# Altium schematic sheet USB_OTG_FS.SchDoc
size A
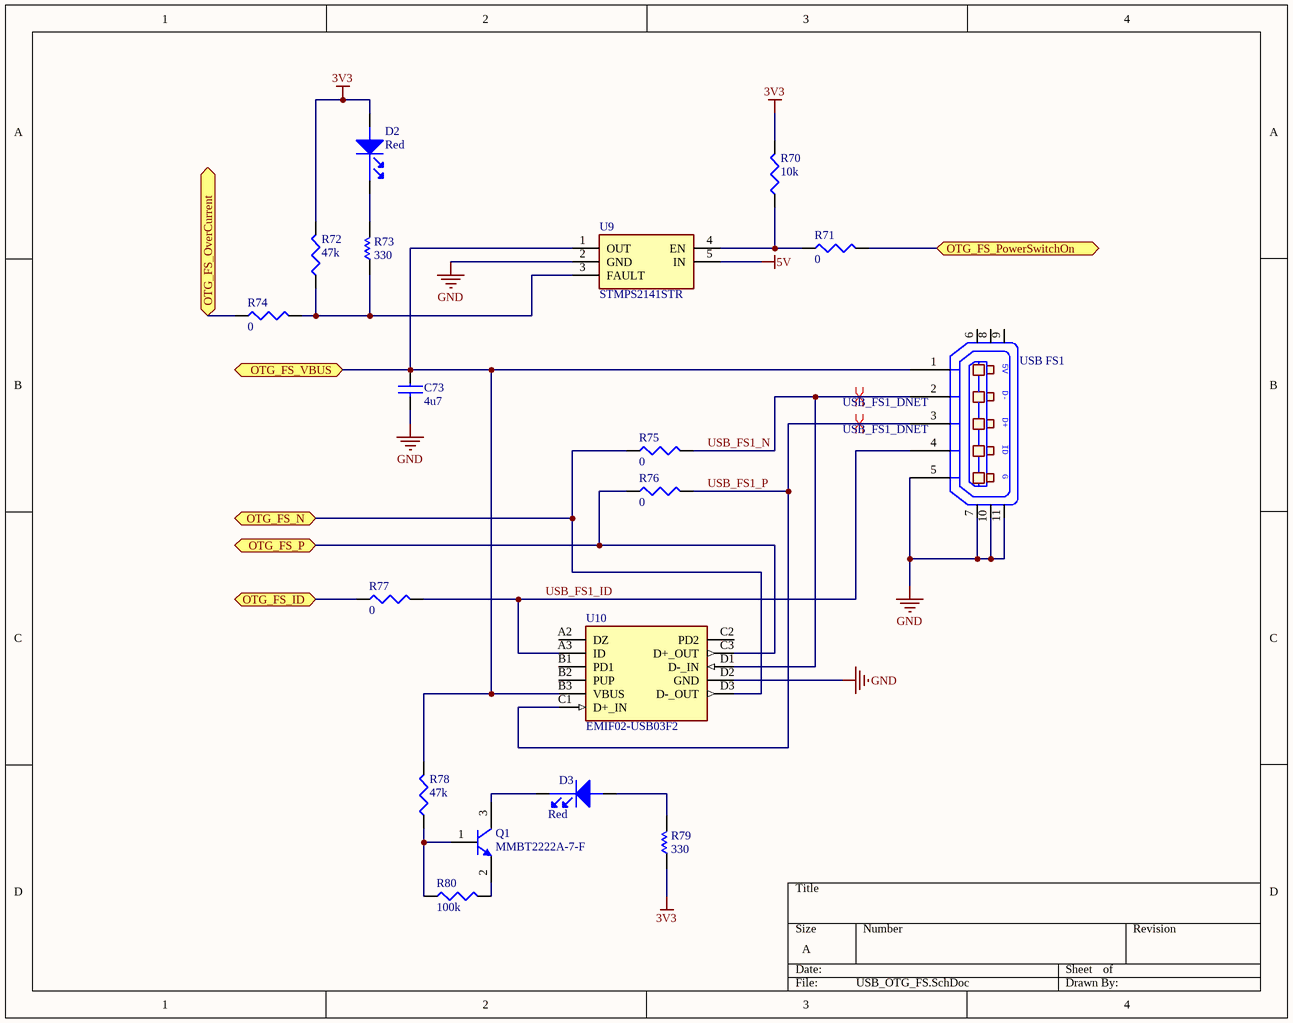
[diagram p0: USB_OTG_FS.SchDoc]

## Parts
C73  4u7  [C0402]
D2  Red  [LED_0603]
D3  Red  [LED_0603]
Q1  MMBT2222A-7-F  [DIOD-SOT23-3_V]
R70  10k  [R0402]
R71  0  [R0402]
R72  47k  [R0402]
R73  330  [RES 1206]
R74  0  [R0402]
R75  0  [R0402]
R76  0  [R0402]
R77  0  [R0402]
R78  47k  [R0402]
R79  330  [RES 1206]
R80  100k  [R0402]
U9  STMPS2141STR  [SOT95P280X145-5N]
U10  EMIF02-USB03F2  [BGA11C50P3X4_144X194X72]
USB_FS1  USB MICRO AB  [USB_Micro_AB]  (value not drawn)

## Ports
OTG_FS_ID (bidir), OTG_FS_N (bidir), OTG_FS_OverCurrent (bidir), OTG_FS_P (bidir), OTG_FS_PowerSwitchOn (bidir), OTG_FS_VBUS (bidir)

## Nets
3V3: D2.2(ANODE) R70.2 R72.2 R79.1
5V: U9.5(IN)
GND: C73.2 U9.2(GND) U10.D2(GND) USB_FS1.5(P5) USB_FS1.7 USB_FS1.10 USB_FS1.11
OTG_FS_ID: R77.1 ; port OTG_FS_ID
OTG_FS_N: R75.1 U10.D3(D-_OUT) ; port OTG_FS_N
OTG_FS_OverCurrent: R74.1 ; port OTG_FS_OverCurrent
OTG_FS_P: R76.1 U10.C3(D+_OUT) ; port OTG_FS_P
OTG_FS_PowerSwitchOn: R71.2 ; port OTG_FS_PowerSwitchOn
OTG_FS_VBUS: C73.1 R78.2 U9.1(OUT) U10.B3(VBUS) USB_FS1.1(P1) ; port OTG_FS_VBUS
USB_FS1_ID: R77.2 U10.A3(ID) USB_FS1.4(P4)
USB_FS1_N: R75.2 U10.D1(D-_IN) USB_FS1.2(P2)
USB_FS1_P: R76.2 U10.C1(D+_IN) USB_FS1.3(P3)
NetD2_1: D2.1(cathode) R73.2
NetD3_1: D3.1(cathode) Q1.3(C)
NetD3_2: D3.2(ANODE) R79.2
NetQ1_1: Q1.1(B) R78.1 R80.1
NetQ1_2: Q1.2(E) R80.2
NetR70_1: R70.1 R71.1 U9.4(EN)
NetR72_1: R72.1 R73.1 R74.2 U9.3(FAULT)

Not connected (* = marked no-connect by the designer): U10 A2(DZ) B1(PD1) B2(PUP) C2(PD2); USB_FS1 6 8 9

## Layout directives
differential pair; differential pair class USB_FS1_DNET: USB_FS1_N, USB_FS1_P

## Notes on the sheet
- (in symbol 0475890001) 5V; D-; D+; ID; G

## Library data of the parts
C73 = C1005X5R1A225K: CAP CER 2.2UF 10V 10% X5R 0402; Manufacturer: TDK Corporation; Capacitance: 2.2µF; .Checked PCB: RF; Supplier 1: Digi-Key; Supplier Part Number 1: 445-7392-1-ND; Manufacturer Part Number: C1005X5R1A225K; RoHS: RoHS Compliant; Category: Capacitors; Stock 1: 22891; Pricing 1: 1=0.42, 10=0.332, 100=0.2, 250=0.15, 500=0.128, 1000=0.1 (USD); Voltage - Rated: 10V; Tolerance: ±10%; Temperature Coefficient: X5R; Mounting Type: Surface Mount, MLCC; Operating Temperature: -55°C ~ 85°C; Applications: General Purpose; Ratings: -; Package / Case: 0402 (1005 Metric); Size / Dimension: 0.039" L x 0.020" W (1.00mm x 0.50mm); Height - Seated (Max): -; Thickness (Max): 0.022" (0.55mm); Lead Spacing: -; Features: -; Packaging: Cut Tape (CT); Lead Style: -; ComponentLink1URL: http://www.tdk.com/pdf/general_B11.pdf; ComponentLink1Description: http://www.tdk.com/pdf/general_B11.pdf; .Checked SCH: RF
D2 D3 = LS L29K-H1J2-1-Z: LED SMARTLED RED 630NM 0603 SMD; Manufacturer: OSRAM Opto Semiconductors Inc; Millicandela Rating: 4.95mcd; Voltage - Forward (Vf) Typ: 1.8V; Current - Test: 2mA; Wavelength - Peak: 643nm; Viewing Angle: 160°; Lens Type: Diffused; Lens Style/Size: Rectangle with Flat Top, 1.3mm x 0.8mm; Luminous Flux @ Current - Test: 20 mlm; .Checked PCB: RF; Supplier 1: Digi-Key; Supplier Part Number 1: 475-1195-1-ND; Manufacturer Part Number: LS L29K-H1J2-1-Z; RoHS: RoHS Compliant; Category: Optoelectronics; Stock 1: 71670; Pricing 1: 1=0.16, 10=0.137, 100=0.1093, 250=0.09564, 500=0.08744 (USD); Color: Red; Wavelength - Dominant: 630nm; Package / Case: 0603 (1608 Metric); Size / Dimension: 1.70mm L x 0.80mm W; Height: 0.65mm; Mounting Type: Surface Mount; Packaging: Cut Tape (CT); ComponentLink1URL: http://catalog.osram-os.com/catalogue/catalogue.do;jsessionid=DB7CFDBAC5AF1E216E45F622E867085A?act=downloadFile&favOid=020000010003f9de000100b6; ComponentLink1Description: http://catalog.osram-os.com/catalogue/catalogue.do;jsessionid=DB7CFDBAC5AF1E216E45F622E867085A?act=downloadFile&favOid=020000010003f9de000100b6; .Checked SCH: RF
Q1 = CMP-1693-00003-1: NPN Small Signal Transistor, 40 V, -55 to 150 degC, 3-Pin SOT23, RoHS, Tape and Reel; Manufacturer: Diodes Inc; ComponentLink1URL: http://www.diodes.com/; ComponentLink2Description: Datasheet; PackageReference: SOT23-3; PartNumber: MMBT2222A-7-F; ComponentLink1Description: Manufacturer URL; ComponentLink2URL: http://www.diodes.com/_files/datasheets/ds30041.pdf; PackageDescription: 3-Pin Small Outline Transistor, Body 2.9 x 1.3 mm, Pitch 0.95 mm; DatasheetVersion: Rev. 16 - 2; Mounting Technology: Surface Mount
R70 R72 R78 = RC0402FR-0710KL: RES 10.0K OHM 1/16W 1% 0402 SMD; Manufacturer: Yageo; Power (Watts): 0.063W, 1/16W; .Checked PCB: used; Temperature Coefficient: ±100ppm/°C; Category: Resistors; Supplier Part Number: 311-10.0KLRCT-ND; Manufacturer Part Number: RC0402FR-0710KL; Package / Case: 0402 (1005 Metric); Price 1k [$]: 0.01421; Tolerance: ±1%; .Checked SCH: used; Supplier: Digikey; Supplier 1: Digi-Key; Supplier Part Number 1: 311-10.0KLRCT-ND; RoHS: RoHS Compliant; Stock 1: 2916495; Pricing 1: 10=0.014, 50=0.0104, 100=0.0079, 250=0.00584, 500=0.00432, 1000=0.00288 (USD); Composition: Thick Film; Features: -; Size / Dimension: 0.039" L x 0.020" W (1.00mm x 0.50mm); Height: 0.016" (0.40mm); Number of Terminations: 2; Packaging: Cut Tape (CT); ComponentLink1URL: http://www.yageo.com/documents/recent/PYu-RC0402_51_RoHS_L_6.pdf; ComponentLink1Description: http://www.yageo.com/documents/recent/PYu-RC0402_51_RoHS_L_6.pdf
  R70: Resistance (Ohms): 10K; Value: 10k
  R72 R78: Resistance (Ohms): 47k; Value: 47k
R71 R74-R77 = RC0402FR-07100RL: RES 100 OHM 1/16W 1% 0402 SMD; Manufacturer: Yageo; Resistance (Ohms): 100; Power (Watts): 0.063W, 1/16W; Value: 100R; .Checked PCB: RF; Temperature Coefficient: ±100ppm/°C; Category: Resistors; Supplier Part Number: 311-100LRCT-ND; Manufacturer Part Number: RC0402FR-07100RL; Package / Case: 0402 (1005 Metric); Price 1k [$]: 0.01421; Tolerance: ±1%; .Checked SCH: RF; Supplier: Digikey; Supplier 1: Digi-Key; Supplier Part Number 1: 311-100LRCT-ND; RoHS: RoHS Compliant; Stock 1: 1682040; Pricing 1: 10=0.014, 50=0.0104, 100=0.0079, 250=0.00584, 500=0.00432, 1000=0.00288 (USD); Composition: Thick Film; Features: -; Size / Dimension: 0.039" L x 0.020" W (1.00mm x 0.50mm); Height: 0.016" (0.40mm); Number of Terminations: 2; Packaging: Cut Tape (CT); ComponentLink1URL: http://www.yageo.com/documents/recent/PYu-RC0402_51_RoHS_L_6.pdf; ComponentLink1Description: http://www.yageo.com/documents/recent/PYu-RC0402_51_RoHS_L_6.pdf
R73 R79 = RESISTOR: value: 330
R80 = RMCF0402FT100K: RES 100K OHM 1/16W 1% 0402 SMD; Manufacturer: Stackpole Electronics Inc; Power (Watts): 0.063W, 1/16W; .Checked PCB: used; Temperature Coefficient: ±100ppm/°C; Category: Resistors; Supplier Part Number: RMCF0402FT100KCT-ND; Manufacturer Part Number: RMCF0402FT100K; Package / Case: 0402 (1005 Metric); Price 1k [$]: 0.00384; Resistance (Ohms): 100K; Tolerance: ±1%; Value: 100k; .Checked SCH: used; Supplier: Digikey; Supplier 1: Digi-Key; Supplier Part Number 1: RMCF0402FT100KCT-ND; RoHS: RoHS Compliant; Stock 1: 95; Pricing 1: 1=0.04, 10=0.025, 50=0.0138, 100=0.0105, 250=0.0078, 500=0.00576, 1000=0.00384 (USD); Composition: Thick Film; Features: -; Size / Dimension: 0.039" L x 0.020" W (1.00mm x 0.50mm); Height: 0.016" (0.40mm); Number of Terminations: 2; Packaging: Cut Tape (CT); ComponentLink1URL: http://www.seielect.com/Catalog/SEI-RMCF.pdf; ComponentLink1Description: http://www.seielect.com/Catalog/SEI-RMCF.pdf
U9 = STMPS2141STR: Switch; Manufacturer_Name: STMicroelectronics; Datasheet Link: http://uk.rs-online.com/web/p/products/8805406; Height: 1.45mm; Manufacturer_Part_Number: STMPS2141STR; Mouser Part Number: 511-STMPS2141STR; Mouser Price/Stock: https://www.mouser.com/Search/Refine.aspx?Keyword=511-STMPS2141STR; RS Part Number: 8805406P; RS Price/Stock: http://uk.rs-online.com/web/p/products/8805406P
U10 = EMIF02-USB03F2: Integrated Circuit; Manufacturer_Name: STMicroelectronics; Datasheet Link: http://www.st.com/content/ccc/resource/technical/document/datasheet/0a/25/37/a6/28/ab/4f/24/CD00042880.pdf/files/CD00042880.pdf/jcr:content/translations/en.CD00042880.pdf; Height: 0.715mm; Manufacturer_Part_Number: EMIF02-USB03F2; Mouser Part Number: 511-EMIF02-USB03F2; Mouser Price/Stock: https://www.mouser.com/Search/Refine.aspx?Keyword=511-EMIF02-USB03F2; RS Part Number: 9172707P; RS Price/Stock: http://uk.rs-online.com/web/p/products/9172707P
USB_FS1 = 0475890001: CONN RCPT MICRO USB AB R/A SMD; Manufacturer: Molex Inc; Connector Type: USB - micro AB; Number of Contacts: 5; Gender: Receptacle; .Creator: MM; Supplier 1: Digi-Key; Manufacturer Part Number: 0475890001; RoHS: RoHS Compliant; Category: Connectors, Interconnects; Stock 1: 12754; Pricing 1: 1=0.81, 10=0.764, 25=0.6872, 50=0.6108, 100=0.5854, 250=0.53452, 500=0.50908 (USD); Packaging: Cut Tape (CT); Specifications: -; Mounting Type: Surface Mount, Right Angle, Horizontal; Features: Board Guide, Shielded; Ingress Protection: -; ComponentLink1URL: http://www.molex.com/pdm_docs/sd/475890001_sd.pdf; ComponentLink1Description: http://www.molex.com/pdm_docs/sd/475890001_sd.pdf; Supplier Part Number 1: WM17143CT-ND; .Checked PCB: MM; .Checked SCH: MM